# EasyEDA Pro project ProProject_Access Control Core_2024-06-07.epro, schematic V2.1.1 Core Schematic

## Sheets
1 Microcontroller: Create Date: 2024-05-16; Page Name: Microcontroller.V2.1.V2.1.1 Core Schematic; Project Name: Access Control V2.1; Schematic Name: V2.1.1 Core Schematic; Update Date: 2024-05-22; Company: RIT SHED MAKERSPACE; Drawn: Jim Heaney; Page Size: A4; Part Number: N/A; Reviewed: Jim Heaney; Version: V2.1.0
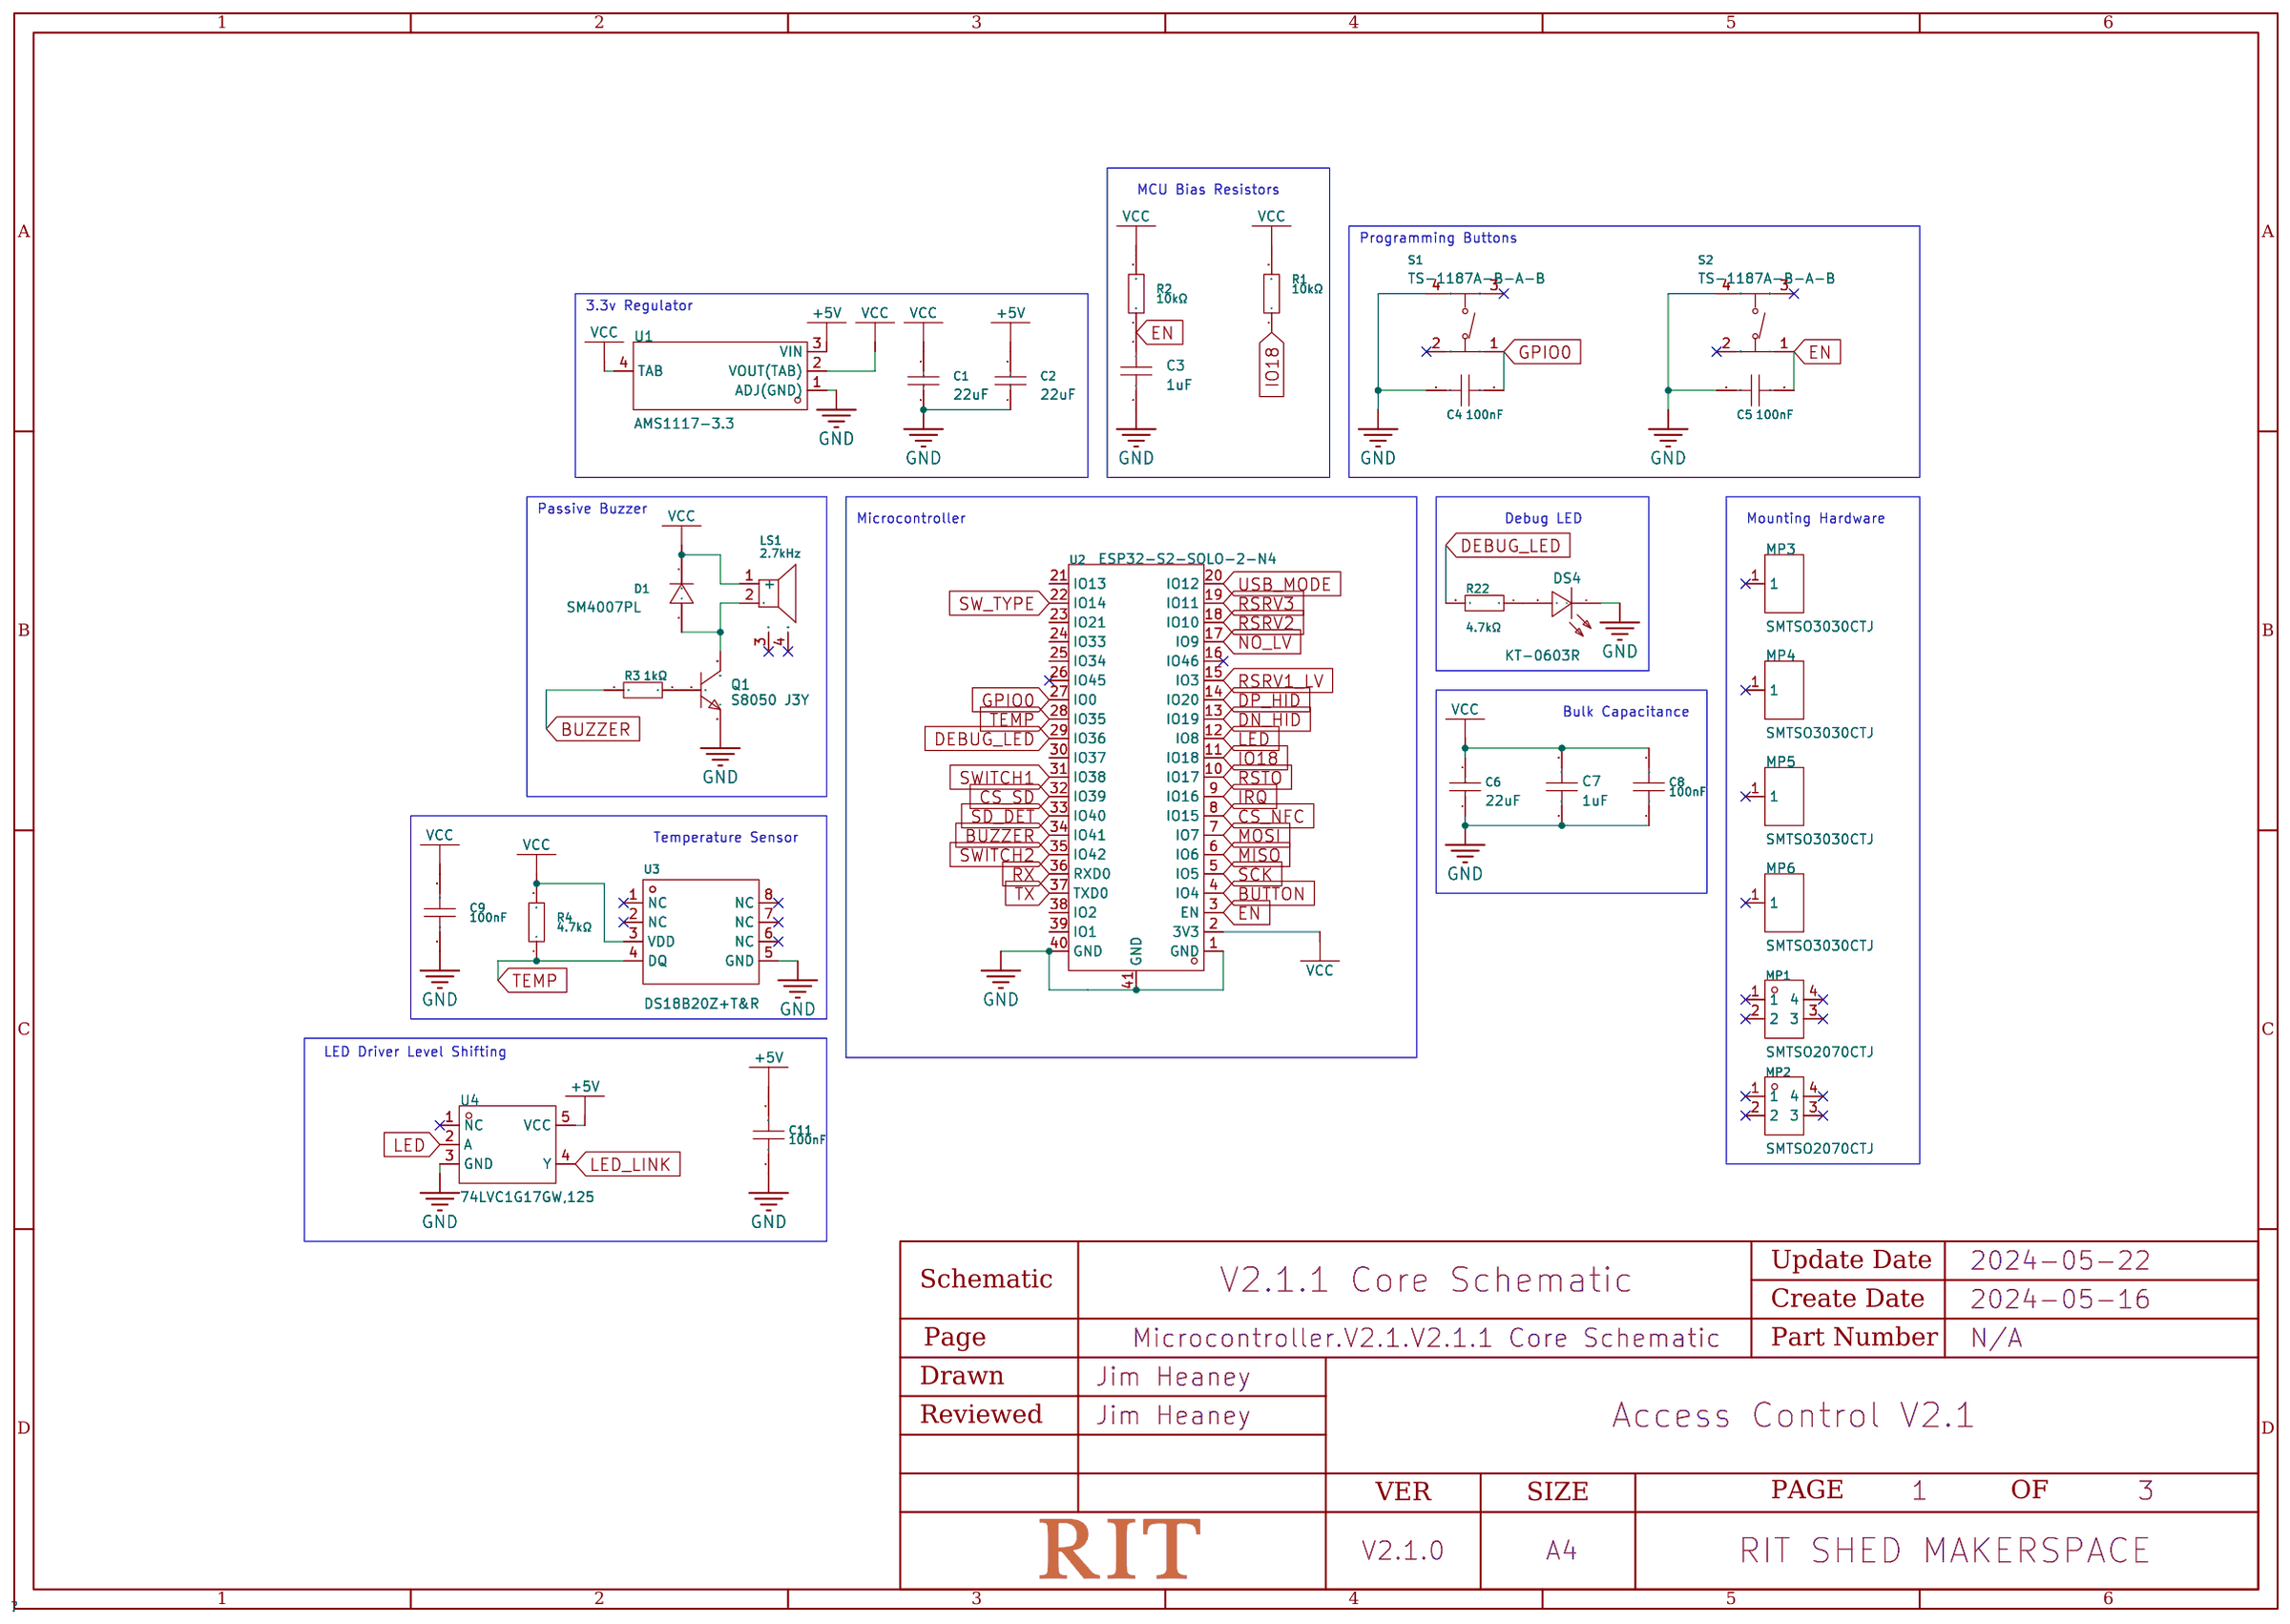
[diagram p4: Microcontroller]
2 Interface: Page Name: Interface; Schematic Name: V2.1.0 Core Schematic; Update Date: 2024-05-20
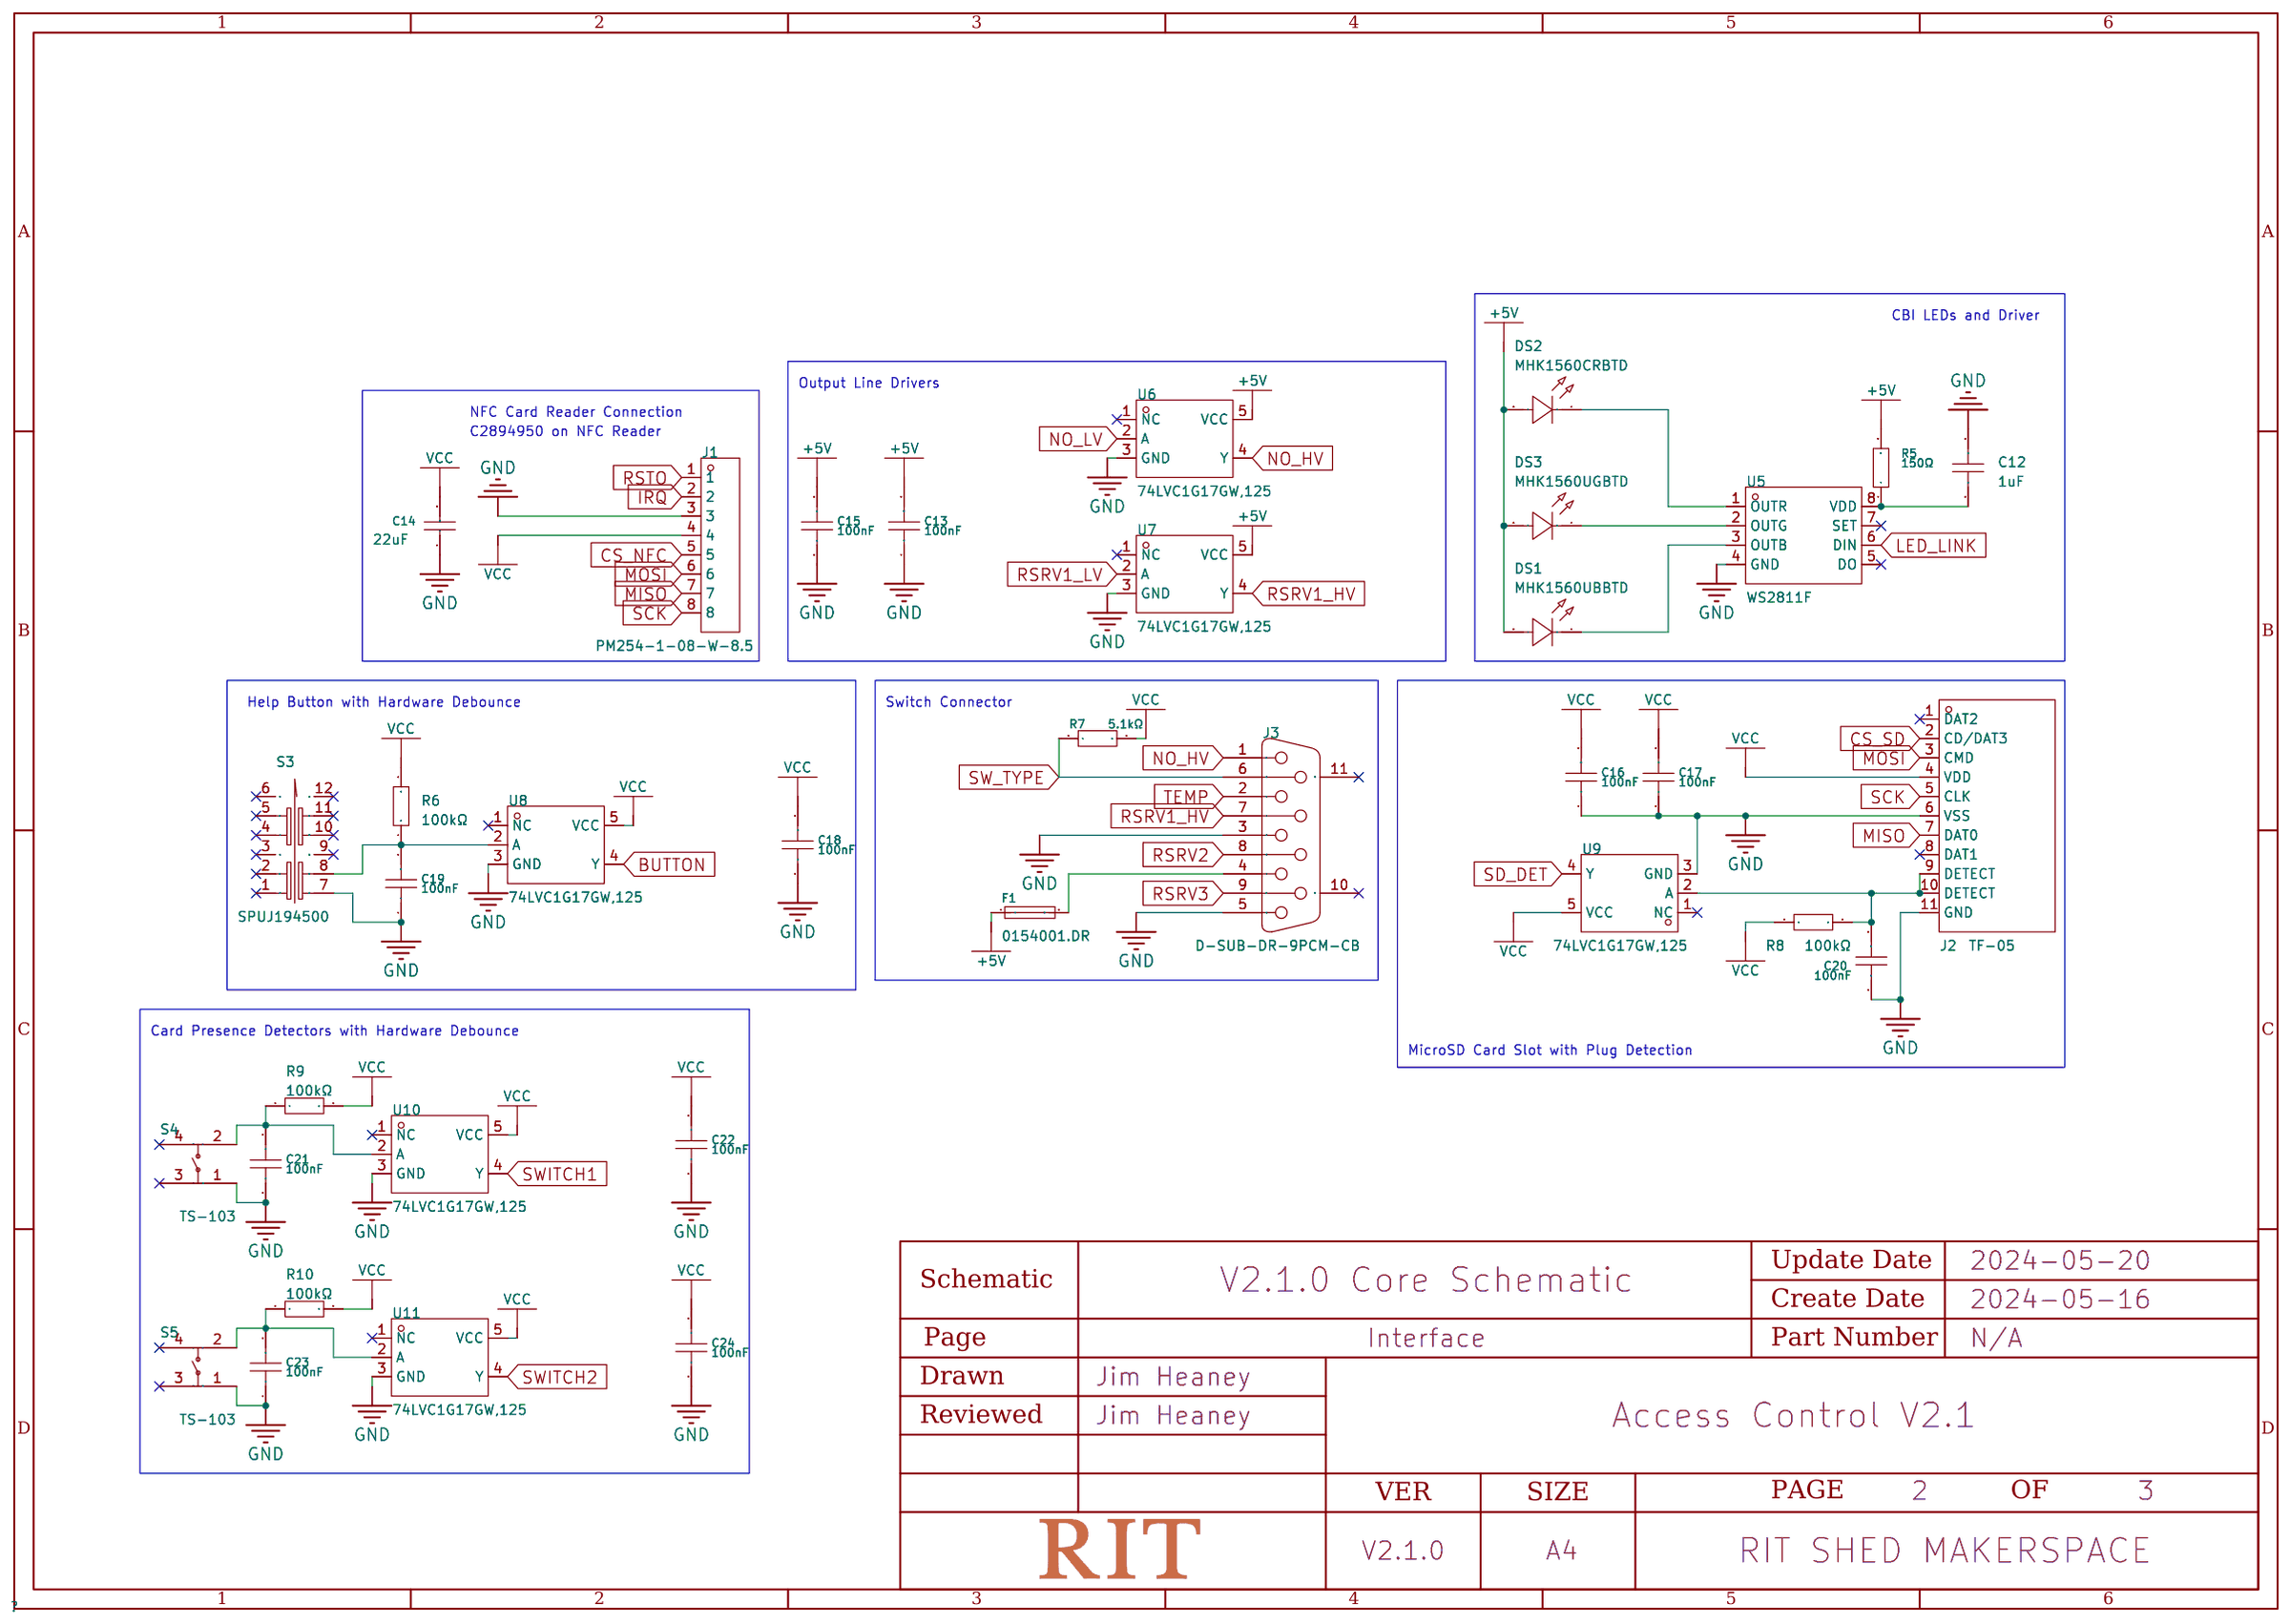
[diagram p5: Interface]
3 USB: Create Date: 2024-05-17; Page Name: USB; Schematic Name: V2.1.0 Core Schematic; Update Date: 2024-05-21
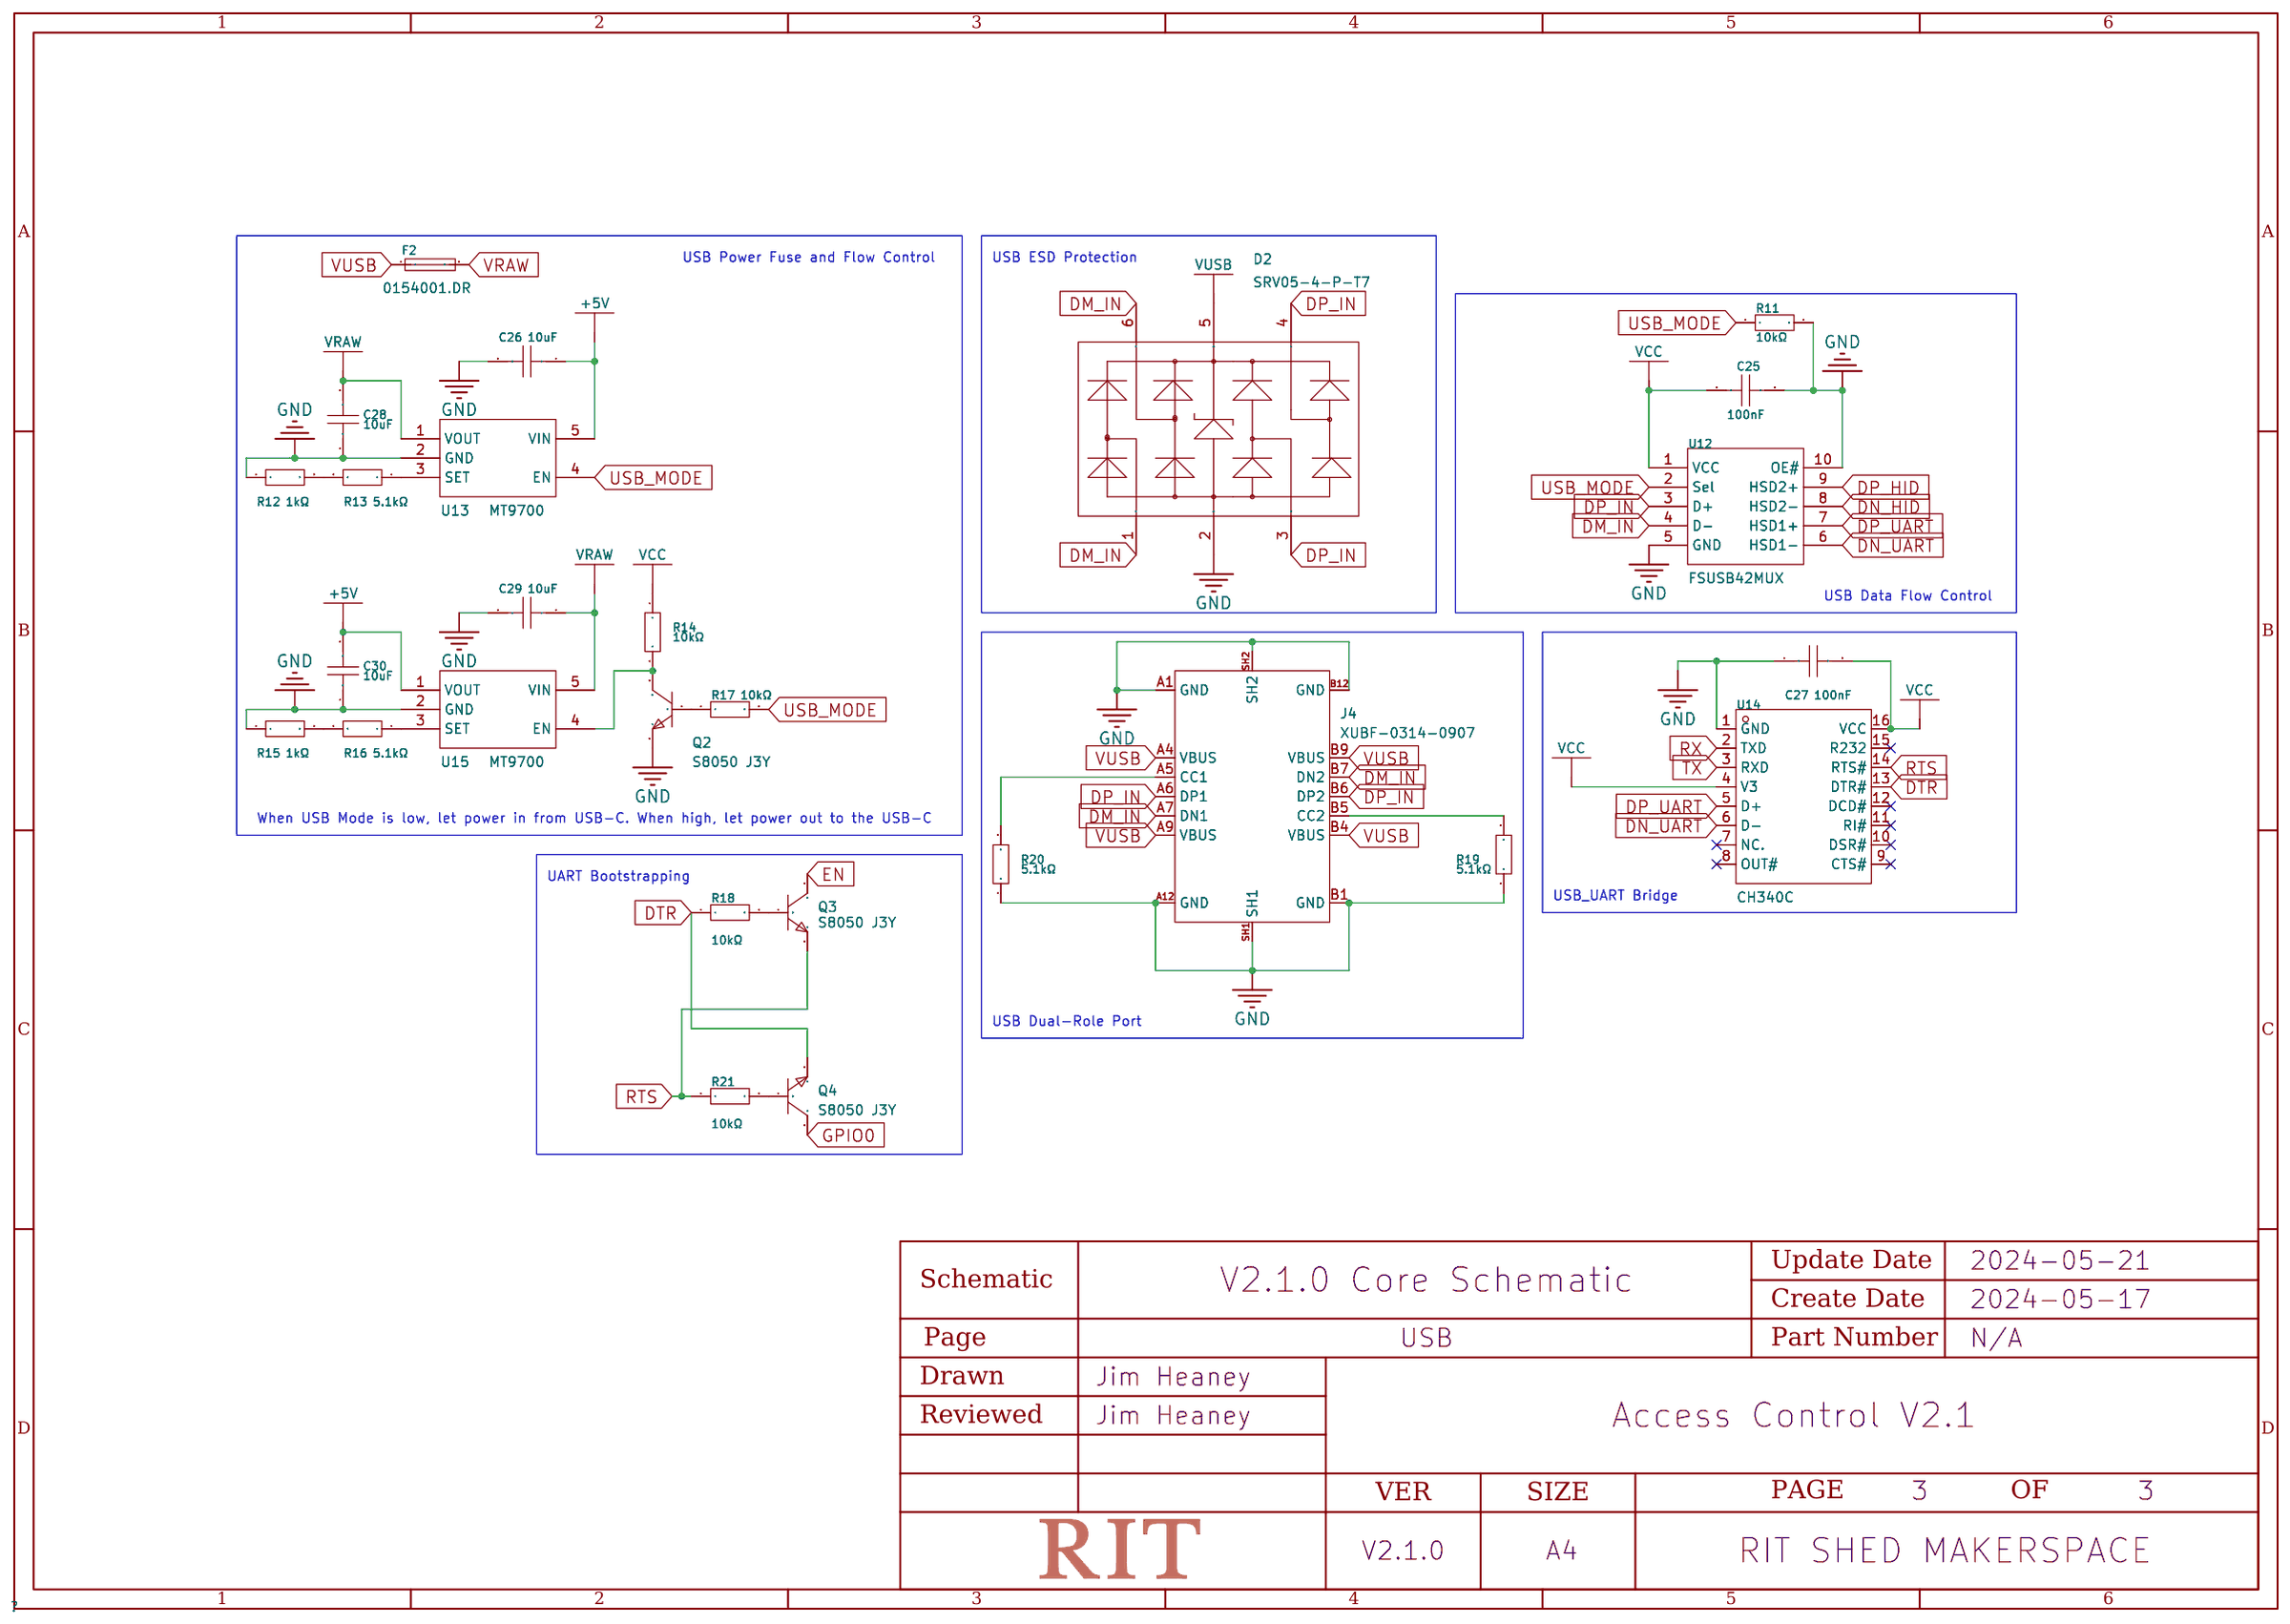
[diagram p6: USB]

## Parts
sheet Interface
C12  1uF  [C0603]
C13  100nF  [C0603]
C14  22uF  [C1206]
C15  100nF  [C0603]
C16  100nF  [C0603]
C17  100nF  [C0603]
C18  100nF  [C0603]
C19  100nF  [C0603]
C20  100nF  [C0603]
C21  100nF  [C0603]
C22  100nF  [C0603]
C23  100nF  [C0603]
C24  100nF  [C0603]
DS1  MHK1560UBBTD  [LED-TH_MHK1560UGBTD]
DS2  MHK1560CRBTD  [LED-TH_MHK1560UGBTD]
DS3  MHK1560UGBTD  [LED-TH_MHK1560UGBTD]
F1  0154001.DR  [FUSE-SMD_L9.8-W5.1]
J1  PM254-1-08-W-8.5  [HDR-TH_8P-P2.54-H-F-W10.0-N]
J2  TF-05  [TF-SMD_TF-05]
J3  D-SUB-DR-9PCM-CB  [DB9-TH_ID09S33E4GV00LF]
R5  150Ω  [R0603]
R6  100kΩ  [R0603]
R7  5.1kΩ  [R0603]
R8  100kΩ  [R0603]
R9  100kΩ  [R0603]
R10  100kΩ  [R0603]
S3  SPUJ194500  [SW-TH_SPUJ194500]
S4  TS-103  [SW-SMD_TS-103]
S5  TS-103  [SW-SMD_TS-103]
U5  WS2811F  [FSOP-8_L3.3-W1.7-P0.80-LS2.9-BL]
U6  74LVC1G17GW,125  [SOT-353_L2.1-W1.3-P0.65-LS2.3-BR]
U7  74LVC1G17GW,125  [SOT-353_L2.1-W1.3-P0.65-LS2.3-BR]
U8  74LVC1G17GW,125  [SOT-353_L2.1-W1.3-P0.65-LS2.3-BR]
U9  74LVC1G17GW,125  [SOT-353_L2.1-W1.3-P0.65-LS2.3-BR]
U10  74LVC1G17GW,125  [SOT-353_L2.1-W1.3-P0.65-LS2.3-BR]
U11  74LVC1G17GW,125  [SOT-353_L2.1-W1.3-P0.65-LS2.3-BR]
sheet Microcontroller
C1  22uF  [C1206]
C2  22uF  [C1206]
C3  1uF  [C0603]
C4  100nF  [C0603]
C5  100nF  [C0603]
C6  22uF  [C1206]
C7  1uF  [C0603]
C8  100nF  [C0603]
C9  100nF  [C0603]
C11  100nF  [C0603]
D1  SM4007PL  [SOD-123F_L2.8-W1.8-LS3.7-RD]
DS4  KT-0603R  [LED0603-RD]
LS1  2.7kHz  [BUZ-SMD_4P-L8.5-W8.5-P8.50-TL]
MP1  SMTSO2070CTJ  [SMD_BD5.6-L5.6-W5.6-D3.6]
MP2  SMTSO2070CTJ  [SMD_BD5.6-L5.6-W5.6-D3.6]
MP3  SMTSO3030CTJ  [SMD_BD5.6-D4.1]
MP4  SMTSO3030CTJ  [SMD_BD5.6-D4.1]
MP5  SMTSO3030CTJ  [SMD_BD5.6-D4.1]
MP6  SMTSO3030CTJ  [SMD_BD5.6-D4.1]
Q1  S8050 J3Y  [SOT-23-3_L3.0-W1.7-P0.95-LS2.9-BR]
R1  10kΩ  [R0603]
R2  10kΩ  [R0603]
R3  1kΩ  [R0603]
R4  4.7kΩ  [R0603]
R22  4.7kΩ  [R0603]
S1  TS-1187A-B-A-B  [SW-SMD_4P-L5.1-W5.1-P3.70-LS6.5-TL-2]
S2  TS-1187A-B-A-B  [SW-SMD_4P-L5.1-W5.1-P3.70-LS6.5-TL-2]
U1  AMS1117-3.3  [SOT-223-4_L6.5-W3.5-P2.30-LS7.0-BR]
U2  2.4GHz  [WIRELM-SMD_ESP32-S3-WROOM-1]
U3  DS18B20Z+T&R  [SOIC-8_L4.9-W3.9-P1.27-LS6.0-BL]
U4  74LVC1G17GW,125  [SOT-353_L2.1-W1.3-P0.65-LS2.3-BR]
sheet USB
C25  100nF  [C0603]
C26  10uF  [C0603]
C27  100nF  [C0603]
C28  10uF  [C0603]
C29  10uF  [C0603]
C30  10uF  [C0603]
D2  SRV05-4-P-T7  [SOT-23-6_L2.9-W1.6-P0.95-LS2.8-BR]
F2  0154001.DR  [FUSE-SMD_L9.8-W5.1]
J4  XUBF-0314-0907  [TYPE-C-TH_TYPE-C-14P-CC-2.6]
Q2  S8050 J3Y  [SOT-23-3_L3.0-W1.7-P0.95-LS2.9-BR]
Q3  S8050 J3Y  [SOT-23-3_L3.0-W1.7-P0.95-LS2.9-BR]
Q4  S8050 J3Y  [SOT-23-3_L3.0-W1.7-P0.95-LS2.9-BR]
R11  10kΩ  [R0603]
R12  1kΩ  [R0603]
R13  5.1kΩ  [R0603]
R14  10kΩ  [R0603]
R15  1kΩ  [R0603]
R16  5.1kΩ  [R0603]
R17  10kΩ  [R0603]
R18  10kΩ  [R0603]
R19  5.1kΩ  [R0603]
R20  5.1kΩ  [R0603]
R21  10kΩ  [R0603]
U12  FSUSB42MUX  [MSOP-10_L3.0-W3.0-P0.50-LS5.0-BL]
U13  MT9700  [SOT-23-5_L3.0-W1.7-P0.95-LS2.8-BR]
U14  CH340C  [SOP-16_L10.0-W3.9-P1.27-LS6.0-BL]
U15  MT9700  [SOT-23-5_L3.0-W1.7-P0.95-LS2.8-BR]

## Library data of the parts
C3 C7 C12 = CL10A105KB8NNNC: Capacitance: Tolerance:±10% Tolerance:±10% Voltage Rated: Temperature Coefficient:; LCSC Part Name: 1uF ±10% 50V; Supplier Part: C15849; Manufacturer: SAMSUNG(三星); Supplier Footprint: 0603; JLCPCB Part Class: Basic Part; Datasheet: https://atta.szlcsc.com/upload/public/pdf/source/20160218/1457707763339.pdf; Supplier: LCSC; Tolerance: ±10%
C4 C5 C8 C9 C11 C13 C15-C25 C27 = CC0603KRX7R9BB104: Capacitance: Tolerance:±10% Tolerance:±10% Voltage Rated: Temperature Coefficient:; LCSC Part Name: 100nF ±10% 50V; Supplier Part: C14663; Manufacturer: YAGEO(国巨); Supplier Footprint: 0603; JLCPCB Part Class: Basic Part; Datasheet: https://atta.szlcsc.com/upload/public/pdf/source/20180910/C282072_33301C7F631E79921B82A8DAC6BCC5B3.pdf; Supplier: LCSC; Tolerance: ±10%
C1 C2 C6 C14 = CL31A226KAHNNNE: Capacitance: Tolerance:±10% Tolerance:±10% Voltage Rated: Temperature Coefficient:; LCSC Part Name: 22uF ±10% 25V; Supplier Part: C12891; Manufacturer: SAMSUNG(三星); Supplier Footprint: 1206; JLCPCB Part Class: Basic Part; Datasheet: https://atta.szlcsc.com/upload/public/pdf/source/20160218/1457707763339.pdf; Supplier: LCSC; Tolerance: ±10%
DS1 = MHK1560UBBTD: 20mA 雾状蓝透镜 50mcd -40℃~+85℃ 460nm~475nm Blue 150° 2.8V~3.4V DIP Light Emitting Diodes (LED) ROHS; LCSC Part Name: 1560直插单灯翠绿色光; Supplier Part: C7470838; Manufacturer: MEIHUA(美华); Supplier Footprint: 插件,P=2.54mm; Datasheet: https://atta.szlcsc.com/upload/public/pdf/source/20231114/0151DB1F997DCF286213A722D08B4BAA.pdf; Supplier: LCSC; Emitted Color: Blue; Forward Voltage (VF): 1.75V~2.2V; Forward Current: 20mA; Dominant Wavelength: 520nm; Lens Color: 雾状绿透镜; Luminous Intensity: 1000mcd; Viewing Angle: 85°; Operating Temperature: -40℃~+85℃
DS2 = MHK1560CGBTD: 20mA 雾状红透镜 50mcd -40℃~+85℃ 632nm Red 85° 1.75V~2.2V Plugin,P=2.54mm Light Emitting Diodes (LED) ROHS; LCSC Part Name: 1560直插单灯翠绿色光; Supplier Part: C7470835; Manufacturer: MEIHUA(美华); Supplier Footprint: 插件,P=2.54mm; JLCPCB Part Class: Extended Part; Datasheet: https://atta.szlcsc.com/upload/public/pdf/source/20231114/0151DB1F997DCF286213A722D08B4BAA.pdf; Supplier: LCSC; Emitted Color: Emerald; Forward Voltage (VF): 1.75V~2.2V; Forward Current: 20mA; Dominant Wavelength: 520nm; Lens Color: 雾状绿透镜; Luminous Intensity: 1000mcd; Viewing Angle: 85°; Operating Temperature: -40℃~+85℃
DS3 = MHK1560UGBTD: Emitted Color:Emerald Forward Voltage (VF):1.75V~2.2V Forward Voltage (VF):1.75V~2.2V Forward Current:20mA Dominant Wavelength:520nm Dominant Wavelength:520nm Lens Color:雾状绿透镜 Luminous Intensity:1000mcd Luminous Intensity:1000mcd Viewing Angle:85° Operati; LCSC Part Name: 1560直插单灯翠绿色光; Supplier Part: C7470833; Manufacturer: MEIHUA(美华); Supplier Footprint: 插件,P=2.54mm; JLCPCB Part Class: Extended Part; Datasheet: https://atta.szlcsc.com/upload/public/pdf/source/20231114/0151DB1F997DCF286213A722D08B4BAA.pdf; Supplier: LCSC; Emitted Color: Emerald; Forward Voltage (VF): 1.75V~2.2V; Forward Current: 20mA; Dominant Wavelength: 520nm; Lens Color: 雾状绿透镜; Luminous Intensity: 1000mcd; Viewing Angle: 85°; Operating Temperature: -40℃~+85℃
F1 F2 = 0154001.DR: Type:SMD Fuse（with Holder） Current Rating:1A Voltage Rating  (AC):125V Voltage Rating (DC):125V Operating Temperature:-55℃~+125℃ Operating Temperature:-55℃~+125℃ Breaking Capacity:50A; LCSC Part Name: 125V贴片式保险丝（含保险丝座）; Supplier Part: C206908; Manufacturer: Littelfuse(美国力特); Supplier Footprint: SMD,9.7x5mm; JLCPCB Part Class: Extended Part; Datasheet: https://atta.szlcsc.com/upload/public/pdf/source/20181031/C315847_D8C8759CD5ED576C0EA975A2D5312378.pdf; Supplier: LCSC; Type: SMD Fuse（with Holder）; Current Rating: 1A; Voltage Rating  (AC): 125V; Voltage Rating (DC): 125V; Operating Temperature: -55℃~+125℃; Breaking Capacity: 50A
J1 = PM254-1-08-W-8.5: Holes Structure:1x8P Pitch:2.54mm Row Spacing:- Circular Hole / Square Hole:Square Holes Mounting Type:Right-Angle Number of Rows:Plugin Number of Holes:8P Current Rating (Max):3A Voltage Rating (Max):- Holes Direction:side Insulation Height:8.5mm Contact; LCSC Part Name: 1x8P 间距:2.54mm 弯插; Supplier Part: C2897390; Manufacturer: HCTL(华灿天禄); Supplier Footprint: 弯插,P=2.54mm; JLCPCB Part Class: Extended Part; Datasheet: https://atta.szlcsc.com/upload/public/pdf/source/20230609/7BA40A3D721268A082DCDEAD4C99131B.pdf; Supplier: LCSC; Holes Structure: 1x8P; Pitch: 2.54mm; Circular Hole / Square Hole: Square Holes; Mounting Type: Right-Angle; Number of Rows: Plugin; Number of Holes: 8P; Current Rating (Max): 3A; Holes Direction: side; Insulation Height: 8.5mm; Contact Material: Copper Alloy; Operating Temperature Range: -40℃~+105℃; Soldering Temperature(Max): 260℃@5S
J2 = TF-05: Card Connection Mode:Self bomb Card Type:MicroSD卡(TF卡) Connector Type:Deck Maximum Body Height:2.05mm Operating Temperature Range:- Operating Temperature Range:-; LCSC Part Name: 自弹式 MicroSD卡(TF卡) 卡座; Supplier Part: C2889263; Manufacturer: Yuandi(元迪); Supplier Footprint: SMD; JLCPCB Part Class: Extended Part; Datasheet: https://atta.szlcsc.com/upload/public/pdf/source/20210830/D84E5BD3B0503701CCACE73CD50987E7.pdf; Supplier: LCSC; Card Connection Mode: Self bomb; Card Type: MicroSD卡(TF卡); Connector Type: Deck; Maximum Body Height: 2.05mm
J3 = D-SUB-DR-9PCM-CB: Connector Type:D-Sub Gender:Female Number of Pins:9P Mounting Style:Right-Angle Number of Rows:2 Current Rating (Max):3A Contact Plating:Tin Operating Temperature Range:-50℃~+105℃ Operating Temperature Range:-50℃~+105℃; LCSC Part Name: D-Sub 母 P数:9P; Supplier Part: C19077337; Manufacturer: XUNPU(讯普); Supplier Footprint: 弯插; JLCPCB Part Class: Extended Part; Datasheet: https://atta.szlcsc.com/upload/public/pdf/source/20231108/FB2E8AB0BE4F620DDF3F7F4D0B9AFB97.pdf; Supplier: LCSC; Connector Type: D-Sub; Gender: Female; Number of Pins: 9P; Mounting Style: Right-Angle; Number of Rows: 2; Current Rating (Max): 3A; Contact Plating: Tin; Operating Temperature Range: -50℃~+105℃
R5 = 0603WAF1500T5E: Type:Thick Film Resistors Resistance: Tolerance:±1% Tolerance:±1% Power(Watts): Overload Voltage (Max): Temperature Coefficient:±100ppm/℃ Temperature Coefficient:±100ppm/℃ Operating Temperature Range:-55℃~+155℃ Operating Temperature Range:-55℃~+155℃; LCSC Part Name: 150Ω ±1% 100mW 厚膜电阻; Supplier Part: C22808; Manufacturer: UNI-ROYAL(厚声); Supplier Footprint: 0603; JLCPCB Part Class: Basic Part; Datasheet: https://atta.szlcsc.com/upload/public/pdf/source/20200306/C422600_1E6D84923E4A46A82E41ADD87F860B5C.pdf; Supplier: LCSC; Type: Thick Film Resistors; Tolerance: ±1%; Temperature Coefficient: ±100ppm/℃; Operating Temperature Range: -55℃~+155℃
R6 R8-R10 = 0603WAF1003T5E: Type:Thick Film Resistors Resistance:100kΩ Tolerance:±1% Tolerance:±1% Power(Watts): Overload Voltage (Max): Temperature Coefficient:±100ppm/℃ Temperature Coefficient:±100ppm/℃ Operating Temperature Range:-55℃~+155℃ Operating Temperature Range:-55℃~+155℃; LCSC Part Name: 100kΩ ±1% 100mW 厚膜电阻; Supplier Part: C25803; Manufacturer: UNI-ROYAL(厚声); Supplier Footprint: 0603; JLCPCB Part Class: Basic Part; Datasheet: https://atta.szlcsc.com/upload/public/pdf/source/20200306/C422600_1E6D84923E4A46A82E41ADD87F860B5C.pdf; Supplier: LCSC; Type: Thick Film Resistors; Tolerance: ±1%; Temperature Coefficient: ±100ppm/℃; Operating Temperature Range: -55℃~+155℃
R7 R13 R16 R19 R20 = 0603WAF5101T5E: Type:Thick Film Resistors Resistance:5.1kΩ Tolerance:±1% Tolerance:±1% Power(Watts): Overload Voltage (Max): Temperature Coefficient:±100ppm/℃ Temperature Coefficient:±100ppm/℃ Operating Temperature Range:-55℃~+155℃ Operating Temperature Range:-55℃~+155℃; LCSC Part Name: 5.1kΩ ±1% 100mW 厚膜电阻; Supplier Part: C23186; Manufacturer: UNI-ROYAL(厚声); Supplier Footprint: 0603; JLCPCB Part Class: Basic Part; Datasheet: https://atta.szlcsc.com/upload/public/pdf/source/20200306/C422600_1E6D84923E4A46A82E41ADD87F860B5C.pdf; Supplier: LCSC; Type: Thick Film Resistors; Tolerance: ±1%; Temperature Coefficient: ±100ppm/℃; Operating Temperature Range: -55℃~+155℃
S3 = SPUJ194500: Circuit:- Self Lock / No Lock:No lock Mechanical Life:1万次 Switch Height:32.5mm Switch Length:8.8mm Switch Width:7.5mm Contact Current:100mA Voltage Rating (AC):- Voltage Rating (DC):30V Insulation Resistance:100MΩ Actuator Style:Projected Plunger Actuator; Supplier Part: C278321; Manufacturer: ALPSALPINE(阿尔卑斯阿尔派); Supplier Footprint: 插件; JLCPCB Part Class: Extended Part; Datasheet: https://atta.szlcsc.com/upload/public/pdf/source/20180906/C278321_9A037C6E63AADC62CDAE467E862D2F4D.pdf; Supplier: LCSC; Self Lock / No Lock: No lock; Mechanical Life: 1万次; Switch Height: 32.5mm; Switch Length: 8.8mm; Switch Width: 7.5mm; Contact Current: 100mA; Voltage Rating (DC): 30V; Insulation Resistance: 100MΩ; Actuator Style: Projected Plunger; Actuator/Cap Color: Blue; Operating Force: 2.3N; Operating Temperature: -10℃~+60℃
S4 S5 = TS-103: Type:Micro Switch Circuit:SPST Actuator Style:Corner flick Switch Length:4.75mm Switch Width:3.6mm Switch Height:3.75mm Contact Current (DC):50mA Voltage Rating (DC):12V Contact Current (AC):- Voltage Rating (AC):- Mechanical Life:10万次 Pin Style:- Operati; LCSC Part Name: 4.75*3.6*3.75mm 贴片微动开关; Supplier Part: C668592; Manufacturer: SHOU HAN(首韩); Supplier Footprint: SMD; JLCPCB Part Class: Extended Part; Datasheet: https://atta.szlcsc.com/upload/public/pdf/source/20200618/C668592_56C85AAF79E541D110C869AD77F2B956.pdf; Supplier: LCSC; Type: Micro Switch; Circuit: SPST; Actuator Style: Corner flick; Switch Length: 4.75mm; Switch Width: 3.6mm; Switch Height: 3.75mm; Contact Current (DC): 50mA; Voltage Rating (DC): 12V; Mechanical Life: 10万次; Operating Temperature: -30℃~+85℃
U5 = WS2811F: Supplier Part: C5446692; Manufacturer: worldsemi; Supplier Footprint: FSOP-8; JLCPCB Part Class: Extended Part; Datasheet: https://atta.szlcsc.com/upload/public/pdf/source/20231008/0D9C9565F1F639D9BF437783A2D39FC9.pdf; Supplier: LCSC
U4 U6-U11 = 74LVC1G17GW,125_C426705: Input type:Schmitt Trigger output type:推挽 Supply Voltage:1.65V~5.5V Supply Voltage:1.65V~5.5V Sink Current:32mA Source Current:32mA Operating Temperature:-40℃~+125℃ Operating Temperature:-40℃~+125℃; Supplier Part: C426705; Manufacturer: Nexperia(安世); Supplier Footprint: TSSOP-5-1.3mm; JLCPCB Part Class: Extended Part; Datasheet: https://atta.szlcsc.com/upload/public/pdf/source/20190910/C426705_BAB226E52F80939C72EFB3D5529BB4FE.pdf; Supplier: LCSC; Input type: Schmitt Trigger; output type: 推挽; Supply Voltage: 1.65V~5.5V; Sink Current: 32mA; Source Current: 32mA; Operating Temperature: -40℃~+125℃
D1 = SM4007PL_C64898: Diode Configuration: Forward Voltage (Vf@If):1.1V@1A Reverse Voltage (Vr): Average Rectified Current (Io): Reverse Leakage Current:10uA@1kV; LCSC Part Name: 电压:1kV 电流:1A; Supplier Part: C64898; Manufacturer: MDD; Supplier Footprint: SOD-123FL; JLCPCB Part Class: Basic Part; Datasheet: https://atta.szlcsc.com/upload/public/pdf/source/20230823/16A8FDE162764C9B685A3717F2DA3690.pdf; Supplier: LCSC; Forward Voltage (Vf@If): 1.1V@1A; Reverse Leakage Current: 10uA@1kV
DS4 = KT-0603R: Emitted Color:Red Power Dissipation:- Forward Current:- Dominant Wavelength:- Dominant Wavelength:- Peak Wavelength:- Diode Configuration:- Lens Color:- Color Temperature:- Color Temperature:- Viewing Angle:- Mounting Sytle:- Operating Temperature:-40℃~+8; LCSC Part Name: 0603 红灯 高亮; Supplier Part: C2286; Manufacturer: KENTO; Supplier Footprint: 0603; JLCPCB Part Class: Basic Part; Datasheet: https://atta.szlcsc.com/upload/public/pdf/source/20160616/1466072038404.pdf; Supplier: LCSC; Emitted Color: Red; Operating Temperature: -40℃~+85℃
LS1 = MLT-8540: Oscillator Circuit:无源(外部驱动) Technology Type:电磁式 Operating Voltage:2.5V~4.5V Operating Voltage:2.5V~4.5V Frequency:2.7kHz Current Consumption:- Sound Pressure Level (SPL):80dB@5V,10cm Diameter (φD):- Length:8.7mm Width:8.7mm Height:4mm Operating Temperatur; Supplier Part: C95300; Manufacturer: 华能; Supplier Footprint: SMD,8.7x8.7mm; JLCPCB Part Class: Extended Part; Datasheet: https://atta.szlcsc.com/upload/public/pdf/source/20170522/1495448323732.pdf; Supplier: LCSC; Oscillator Circuit: 无源(外部驱动); Technology Type: 电磁式; Operating Voltage: 2.5V~4.5V; Sound Pressure Level (SPL): 80dB@5V,10cm; Length: 8.7mm; Width: 8.7mm; Height: 4mm
MP1 MP2 = SMTSO2070CTJ: specifications:M2X7 surface treatment:镀锡 Product Description:- material quality:- model:SMTSO2070CTJ brand:Sinhoo(雄和远景); LCSC Part Name: 雄和远景，电路板表贴圆螺母柱，M2X7，铜镀锡,1个; Supplier Part: C2916355; Manufacturer: Sinhoo(雄和远景); JLCPCB Part Class: Extended Part; Datasheet: https://atta.szlcsc.com/upload/public/pdf/source/20211122/17CF5E24EB4D4DC090A80DE3D7DE5E21.pdf; Supplier: LCSC; specifications: M2X7; surface treatment: 镀锡; brand: Sinhoo(雄和远景)
MP3-MP6 = SMTSO3030CTJ: specifications:M3X3 surface treatment:镀锡 Product Description:- material quality:-; LCSC Part Name: 雄和远景，电路板表贴圆螺母柱，M3X3，铜镀锡,1个; Supplier Part: C2915308; Manufacturer: Sinhoo(雄和远景); JLCPCB Part Class: Extended Part; Datasheet: https://atta.szlcsc.com/upload/public/pdf/source/20211122/17CF5E24EB4D4DC090A80DE3D7DE5E21.pdf; Supplier: LCSC; specifications: M3X3; surface treatment: 镀锡
Q1-Q4 = S8050 J3Y_C2146: Transistor Type: Collector Current (Ic): Collector-Emitter Breakdown Voltage (Vceo): Power Dissipation (Pd): DC Current Gain (hFE@Ic,Vce):200@50mA,1V DC Current Gain (hFE@Ic,Vce):200@50mA,1V Transition Frequency (fT):150MHz Collector Cut-Off Current (Icbo; LCSC Part Name: S8050 J3Y(RANGE:200-350) H档(200-350); Supplier Part: C2146; Manufacturer: CJ(江苏长电/长晶); Supplier Footprint: SOT-23; JLCPCB Part Class: Basic Part; Datasheet: https://atta.szlcsc.com/upload/public/pdf/source/20140809/1457707209234.pdf; Supplier: LCSC; DC Current Gain (hFE@Ic,Vce): 200@50mA,1V; Transition Frequency (fT): 150MHz; Collector Cut-Off Current (Icbo): 100nA; Collector-Emitter Saturation Voltage (VCE(sat)@Ic,Ib): 600mV@500mA,50mA
R1 R2 R11 R14 R17 R18 R21 = 0603WAF1002T5E: Type:Thick Film Resistors Resistance:10kΩ Tolerance:±1% Tolerance:±1% Power(Watts): Overload Voltage (Max): Temperature Coefficient:±100ppm/℃ Temperature Coefficient:±100ppm/℃ Operating Temperature Range:-55℃~+155℃ Operating Temperature Range:-55℃~+155℃; LCSC Part Name: 厚膜电阻 10kΩ ±1% 100mW; Supplier Part: C25804; Manufacturer: UNI-ROYAL(厚声); Supplier Footprint: 0603; JLCPCB Part Class: Basic Part; Datasheet: https://atta.szlcsc.com/upload/public/pdf/source/20200306/C422600_1E6D84923E4A46A82E41ADD87F860B5C.pdf; Supplier: LCSC; Type: Thick Film Resistors; Tolerance: ±1%; Temperature Coefficient: ±100ppm/℃; Operating Temperature Range: -55℃~+155℃
R3 R12 R15 = 0603WAF1001T5E: Type:Thick Film Resistors Resistance:1kΩ Tolerance:±1% Tolerance:±1% Power(Watts): Overload Voltage (Max): Temperature Coefficient:±100ppm/℃ Temperature Coefficient:±100ppm/℃ Operating Temperature Range:-55℃~+155℃ Operating Temperature Range:-55℃~+155℃; LCSC Part Name: 1kΩ ±1% 100mW 厚膜电阻; Supplier Part: C21190; Manufacturer: UNI-ROYAL(厚声); Supplier Footprint: 0603; JLCPCB Part Class: Basic Part; Datasheet: https://atta.szlcsc.com/upload/public/pdf/source/20200306/C422600_1E6D84923E4A46A82E41ADD87F860B5C.pdf; Supplier: LCSC; Type: Thick Film Resistors; Tolerance: ±1%; Temperature Coefficient: ±100ppm/℃; Operating Temperature Range: -55℃~+155℃
R4 R22 = 0603WAF4701T5E: Type:Thick Film Resistors Resistance:4.7kΩ Tolerance:±1% Tolerance:±1% Power(Watts): Overload Voltage (Max): Temperature Coefficient:±100ppm/℃ Temperature Coefficient:±100ppm/℃ Operating Temperature Range:-55℃~+155℃ Operating Temperature Range:-55℃~+155℃; LCSC Part Name: 4.7kΩ ±1% 100mW 厚膜电阻; Supplier Part: C23162; Manufacturer: UNI-ROYAL(厚声); Supplier Footprint: 0603; JLCPCB Part Class: Basic Part; Datasheet: https://atta.szlcsc.com/upload/public/pdf/source/20200306/C422600_1E6D84923E4A46A82E41ADD87F860B5C.pdf; Supplier: LCSC; Type: Thick Film Resistors; Tolerance: ±1%; Temperature Coefficient: ±100ppm/℃; Operating Temperature Range: -55℃~+155℃
S1 S2 = TS-1187A-B-A-B: Circuit:SPST Actuator Style:Round Button Operating Force:160gf Mounting Style:Brick nogging Switch Length:5.1mm Switch Width:5.1mm Switch Height:1.5mm Strike Gundam:不带 Contact Current:50mA Voltage Rating (DC):12V Insulation Resistance:- Actuator/Cap Color; LCSC Part Name: 5.1*5.1*1.5mm 立贴 轻触开关; Supplier Part: C318884; Manufacturer: XKB Connectivity(中国星坤); Supplier Footprint: SMD; JLCPCB Part Class: Basic Part; Datasheet: https://atta.szlcsc.com/upload/public/pdf/source/20200227/C318890_053E50208A88A7BA1965D8746000774E.pdf; Supplier: LCSC; Circuit: SPST; Actuator Style: Round Button; Operating Force: 160gf; Mounting Style: Brick nogging; Switch Length: 5.1mm; Switch Width: 5.1mm; Switch Height: 1.5mm; Strike Gundam: 不带; Contact Current: 50mA; Voltage Rating (DC): 12V; Actuator/Cap Color: 金色; With Lamp: No; Mechanical Life: 10万次; Operating Temperature: -30℃~+85℃
U1 = AMS1117-3.3_C347222: Output Type: Maximum Input Voltage:12V Output Voltage:3.3V Output Voltage:3.3V MAX Output Current:1A Power Supply Rejection Ratio (PSRR):60dB@(120Hz) Dropout Voltage:1.3V@(1A) standby current:- Noise:- Feature:- Operating Temperature:- Operating Temperatu; LCSC Part Name: 输出:3.3V 电流:1A 耐压:12V; Supplier Part: C347222; Manufacturer: UMW(友台半导体); Supplier Footprint: SOT-223; JLCPCB Part Class: Extended Part; Datasheet: https://atta.szlcsc.com/upload/public/pdf/source/20231109/155D79A26D9DB04352555A58D5969DC8.pdf; Supplier: LCSC; Maximum Input Voltage: 12V; Output Voltage: 3.3V; MAX Output Current: 1A; Power Supply Rejection Ratio (PSRR): 60dB@(120Hz); Dropout Voltage: 1.3V@(1A); Output Polarity: Positive electrode; Number of Outputs: 1
U2 = ESP32-S2-SOLO-2-N4: Core Processor:ESP32-S2芯片 Support Interface:I2C；GPIO；SPI；PWM；ADC；UART；USB；I2S Frequency:2.4GHz Output Power:19.5dBm Output Power:19.5dBm; Supplier Part: C3040594; Manufacturer: ESPRESSIF(乐鑫); Supplier Footprint: SMD-41P; JLCPCB Part Class: Extended Part; Datasheet: https://atta.szlcsc.com/upload/public/pdf/source/20220829/68E69EF550BFD22B9418B9E05FF4E453.pdf; Supplier: LCSC; Core Processor: ESP32-S2芯片; Support Interface: I2C；GPIO；SPI；PWM；ADC；UART；USB；I2S; Output Power: 19.5dBm
U3 = DS18B20Z+T&R: Supply Voltage:3V~5.5V Supply Voltage:3V~5.5V; LCSC Part Name: DS18B20Z&R; Supplier Part: C97190; Manufacturer: ADI(亚德诺)/MAXIM(美信); Supplier Footprint: SOIC-8; JLCPCB Part Class: Extended Part; Datasheet: https://atta.szlcsc.com/upload/public/pdf/source/20170713/C118507_1499918901893816791.pdf; Supplier: LCSC; Supply Voltage: 3V~5.5V
C26 C28-C30 = CL10A106MA8NRNC: Capacitance: Tolerance:±20% Tolerance:±20% Voltage Rated: Temperature Coefficient:; LCSC Part Name: 10uF ±20% 25V; Supplier Part: C96446; Manufacturer: SAMSUNG(三星); Supplier Footprint: 0603; JLCPCB Part Class: Basic Part; Datasheet: https://atta.szlcsc.com/upload/public/pdf/source/20160218/1457707763339.pdf; Supplier: LCSC; Tolerance: ±20%
D2 = SRV05-4-P-T7_C85364: Reverse Stand-Off Voltage (Vrwm):5V Breakdown Voltage:6V Peak Pulse Current (Ipp)@10/1000s:1A@8/20us Maximum Clamping Voltage:12V; LCSC Part Name: Vrwm:5V; Supplier Part: C85364; Manufacturer: PROTEK; Supplier Footprint: SOT-23-6; Datasheet: https://atta.szlcsc.com/upload/public/pdf/source/20161024/1477288764689.pdf; Supplier: LCSC; Reverse Stand-Off Voltage (Vrwm): 5V; Breakdown Voltage: 6V; Peak Pulse Current (Ipp)@10/1000μs: 1A@8/20us; Maximum Clamping Voltage: 12V
J4 = TYPE-C 14P CC-2.6: DIY of C7527703; LCSC Part Name: Type-C 母 侧插; Supplier Part: C7527703; Manufacturer: Lian Xin Technology; Supplier Footprint: 插件; JLCPCB Part Class: Extended Part; Datasheet: https://wmsc.lcsc.com/wmsc/upload/file/pdf/v2/lcsc/2308251143_Lian-Xin-Technology-XUBF-0314-0907_C7527703.pdf; Supplier: LCSC; Connector Type: Type-C; Gender: Female; Number of Ports: 1; Number of Contacts: 14P; Mounting Style: Side insertion; Current Rating - Power (Max): 3A; Operating Temperature Range: -30℃~+85℃
U12 = FSUSB42MUX: Supply Voltage:2.4V~4.4V Supply Voltage:2.4V~4.4V On-State Resistance (Max):6.5Ω; LCSC Part Name: 小功率，两端口，高速 USB2.0 (480Mbps) 开关; Supplier Part: C11355; Manufacturer: onsemi(安森美); Supplier Footprint: MSOP-10; JLCPCB Part Class: Extended Part; Datasheet: https://atta.szlcsc.com/upload/public/pdf/source/20130225/1457706594597.pdf; Supplier: LCSC; Supply Voltage: 2.4V~4.4V; On-State Resistance (Max): 6.5Ω
U13 U15 = MT9700: Supplier Part: C89855; Manufacturer: 西安航天民芯; Supplier Footprint: SOT-23-5; JLCPCB Part Class: Extended Part; Datasheet: https://atta.szlcsc.com/upload/public/pdf/source/20170418/1492481333031.pdf; Supplier: LCSC
U14 = CH340C: Applications Function:Transceiver Protocol: Supply Voltage:3.3V；5V Supply Voltage:3.3V；5V Data Rate:2Mbps; LCSC Part Name: CH340C USB转串口芯片 CH340; Supplier Part: C84681; Manufacturer: WCH(南京沁恒); Supplier Footprint: SOP-16; JLCPCB Part Class: Extended Part; Datasheet: https://atta.szlcsc.com/upload/public/pdf/source/20200819/C84681_ADBED554CE321879DBD6B1D06488689C.pdf; Supplier: LCSC; Applications Function: Transceiver; Supply Voltage: 3.3V；5V; Data Rate: 2Mbps

## Nets
+5V: C2.2 C11.2 C13.2 C15.2 C26.1 C30.2 DS1.2(A) DS2.2(A) DS3.2(A) F1.1 R5.2 U1.3(VIN) U4.5(VCC) U6.5(VCC) U7.5(VCC) U13.5(VIN) U15.1(VOUT)
GND: C1.1 C2.1 C3.1 C4.1 C5.1 C6.1 C7.1 C8.1 C9.1 C11.1 C12.2 C13.1 C14.1 C15.1 C16.1 C17.1 C18.1 C19.1 C20.1 C21.1 C22.1 C23.1 C24.1 C25.2 C26.2 C27.1 C28.1 C29.2 C30.1 D2.2 DS4.1(K) J1.3 J2.6(VSS) J2.11(GND) J3.3 J3.5 J4.A1(GND) J4.A12(GND) J4.B1(GND) J4.B12(GND) J4.SH1 J4.SH2 Q1.2(E) Q2.2(E) R11.1 R12.1 R15.1 R19.1 R20.1 S1.4(D) S2.4(D) S3.7 S4.1 S5.1 U1.1(ADJ(GND)) U2.1(GND) U2.40(GND) U2.41(GND) U3.5(GND) U4.3(GND) U5.4(GND) U6.3(GND) U7.3(GND) U8.3(GND) U9.3(GND) U10.3(GND) U11.3(GND) U12.5(GND) U12.10(OE#) U13.2(GND) U14.1(GND) U15.2(GND)
VCC: C1.2 C6.2 C7.2 C8.2 C9.2 C14.2 C16.2 C17.2 C18.2 C22.2 C24.2 C25.1 C27.2 D1.1(C) J1.4 J2.4(VDD) LS1.1(+) R1.2 R2.2 R4.2 R6.2 R7.2 R8.1 R9.2 R10.2 R14.1 U1.2(VOUT(TAB)) U1.4(TAB) U2.2(3V3) U3.3(VDD) U8.5(VCC) U9.5(VCC) U10.5(VCC) U11.5(VCC) U12.1(VCC) U14.4(V3) U14.16(VCC)
BUTTON: U2.4(IO4) U8.4(Y)
BUZZER: R3.1 U2.34(IO41)
CS_NFC: J1.5 U2.8(IO15)
CS_SD: J2.2(CD/DAT3) U2.32(IO39)
DEBUG_LED: R22.2 U2.29(IO36)
DM_IN: D2.1 D2.6 J4.A7(DN1) J4.B7(DN2) U12.4(D-)
DN_HID: U2.13(IO19) U12.8(HSD2-)
DN_UART: U12.6(HSD1-) U14.6(D-)
DP_HID: U2.14(IO20) U12.9(HSD2+)
DP_IN: D2.3 D2.4 J4.A6(DP1) J4.B6(DP2) U12.3(D+)
DP_UART: U12.7(HSD1+) U14.5(D+)
DTR: Q4.2(E) R18.1 U14.13(DTR#)
EN: C3.2 C5.2 Q3.3(C) R2.1 S2.1(A) U2.3(EN)
GPIO0: C4.2 Q4.3(C) S1.1(A) U2.27(IO0)
IO18: R1.1 U2.11(IO18)
IRQ: J1.2 U2.9(IO16)
LED: U2.12(IO8) U4.2(A)
LED_LINK: U4.4(Y) U5.6(DIN)
MISO: J1.7 J2.7(DAT0) U2.6(IO6)
MOSI: J1.6 J2.3(CMD) U2.7(IO7)
NO_HV: J3.1 U6.4(Y)
NO_LV: U2.17(IO9) U6.2(A)
RSRV1_HV: J3.7 U7.4(Y)
RSRV1_LV: U2.15(IO3) U7.2(A)
RSRV2: J3.8 U2.18(IO10)
RSRV3: J3.9 U2.19(IO11)
RSTO: J1.1 U2.10(IO17)
RTS: Q3.2(E) R21.1 U14.14(RTS#)
RX: U2.36(RXD0) U14.2(TXD)
SCK: J1.8 J2.5(CLK) U2.5(IO5)
SD_DET: U2.33(IO40) U9.4(Y)
SW_TYPE: J3.6 R7.1 U2.22(IO14)
SWITCH1: U2.31(IO38) U10.4(Y)
SWITCH2: U2.35(IO42) U11.4(Y)
TEMP: J3.2 R4.1 U2.28(IO35) U3.4(DQ)
TX: U2.37(TXD0) U14.3(RXD)
USB_MODE: R11.2 R17.2 U2.20(IO12) U12.2(Sel) U13.4(EN)
VRAW: C28.2 C29.1 F2.2 U13.1(VOUT) U15.5(VIN)
VUSB: D2.5 F2.1 J4.A4(VBUS) J4.A9(VBUS) J4.B4(VBUS) J4.B9(VBUS)
$1N5366: Q1.1(B) R3.2
$1N5377: D1.2(A) LS1.2 Q1.3(C)
$1N8540: DS4.2(A) R22.1
$3N949: C12.1 R5.1 U5.8(VDD)
$3N1025: DS1.1(K) U5.3(OUTB)
$3N1030: DS3.1(K) U5.2(OUTG)
$3N1036: DS2.1(K) U5.1(OUTR)
$3N2018: C23.2 R10.1 S5.2 U11.2(A)
$3N2026: C21.2 R9.1 S4.2 U10.2(A)
$3N2473: C19.2 R6.1 S3.8 U8.2(A)
$3N3241: C20.2 J2.9(DETECT) J2.10(DETECT) R8.2 U9.2(A)
$3N3342: F1.2 J3.4
$4N1616: Q2.3(C) R14.2 U15.4(EN)
$4N1624: Q2.1(B) R17.1
$4N1628: R12.2 R13.2
$4N1630: R15.2 R16.2
$4N1632: R16.1 U15.3(SET)
$4N1650: R13.1 U13.3(SET)
$4N1730: Q4.1(B) R21.2
$4N1732: Q3.1(B) R18.2
$4N5448: J4.A5(CC1) R20.2
$4N5456: J4.B5(CC2) R19.2

Not connected (* = marked no-connect by the designer): J2 1(DAT2)* 8(DAT1)*; J3 10(MH1)* 11(MH2)*; LS1 3(NC)* 4(NC)*; MP1 1* 2* 3* 4*; MP2 1* 2* 3* 4*; MP3 1*; MP4 1*; MP5 1*; MP6 1*; S1 2(B)* 3(C)*; S2 2(B)* 3(C)*; S3 1* 2* 3* 4* 5* 6* 9* 10* 11* 12*; S4 3* 4*; S5 3* 4*; U2 16(IO46)* 21(IO13) 23(IO21) 24(IO33) 25(IO34) 26(IO45)* 30(IO37) 38(IO2) 39(IO1); U3 1(NC)* 2(NC)* 6(NC)* 7(NC)* 8(NC)*; U4 1(NC)*; U5 5(DO)* 7(SET)*; U6 1(NC)*; U7 1(NC)*; U8 1(NC)*; U9 1(NC)*; U10 1(NC)*; U11 1(NC)*; U14 7(NC.)* 8(OUT#)* 9(CTS#)* 10(DSR#)* 11(RI#)* 12(DCD#)* 15(R232)*

## Notes on the sheets
sheet 1
- MCU Bias Resistors
- Programming Buttons
- 3.3v Regulator
- Passive Buzzer
- Microcontroller
- Debug LED
- Mounting Hardware
- Bulk Capacitance
- Temperature Sensor
- LED Driver Level Shifting
sheet 2
- CBI LEDs and Driver
- Output Line Drivers
- NFC Card Reader Connection
- C2894950 on NFC Reader
- Help Button with Hardware Debounce
- Switch Connector
- Card Presence Detectors with Hardware Debounce
- MicroSD Card Slot with Plug Detection
sheet 3
- USB Power Fuse and Flow Control
- USB ESD Protection
- USB Data Flow Control
- When USB Mode is low, let power in from USB-C. When high, let power out to the USB-C
- UART Bootstrapping
- USB_UART Bridge
- USB Dual-Role Port
